# EasyEDA Pro project ProPrj_15串v2.0_2025-09-09.epro

# Schematic 15串v2.0
Board Name: 15串; Create Date: 2025-01-18; Page Name: P1; Project Name: 15串v2.0; Schematic Name: 15串v2.0; Update Date: 2025-01-21; Company: HUR; Page Size: A2; Version: V1.0
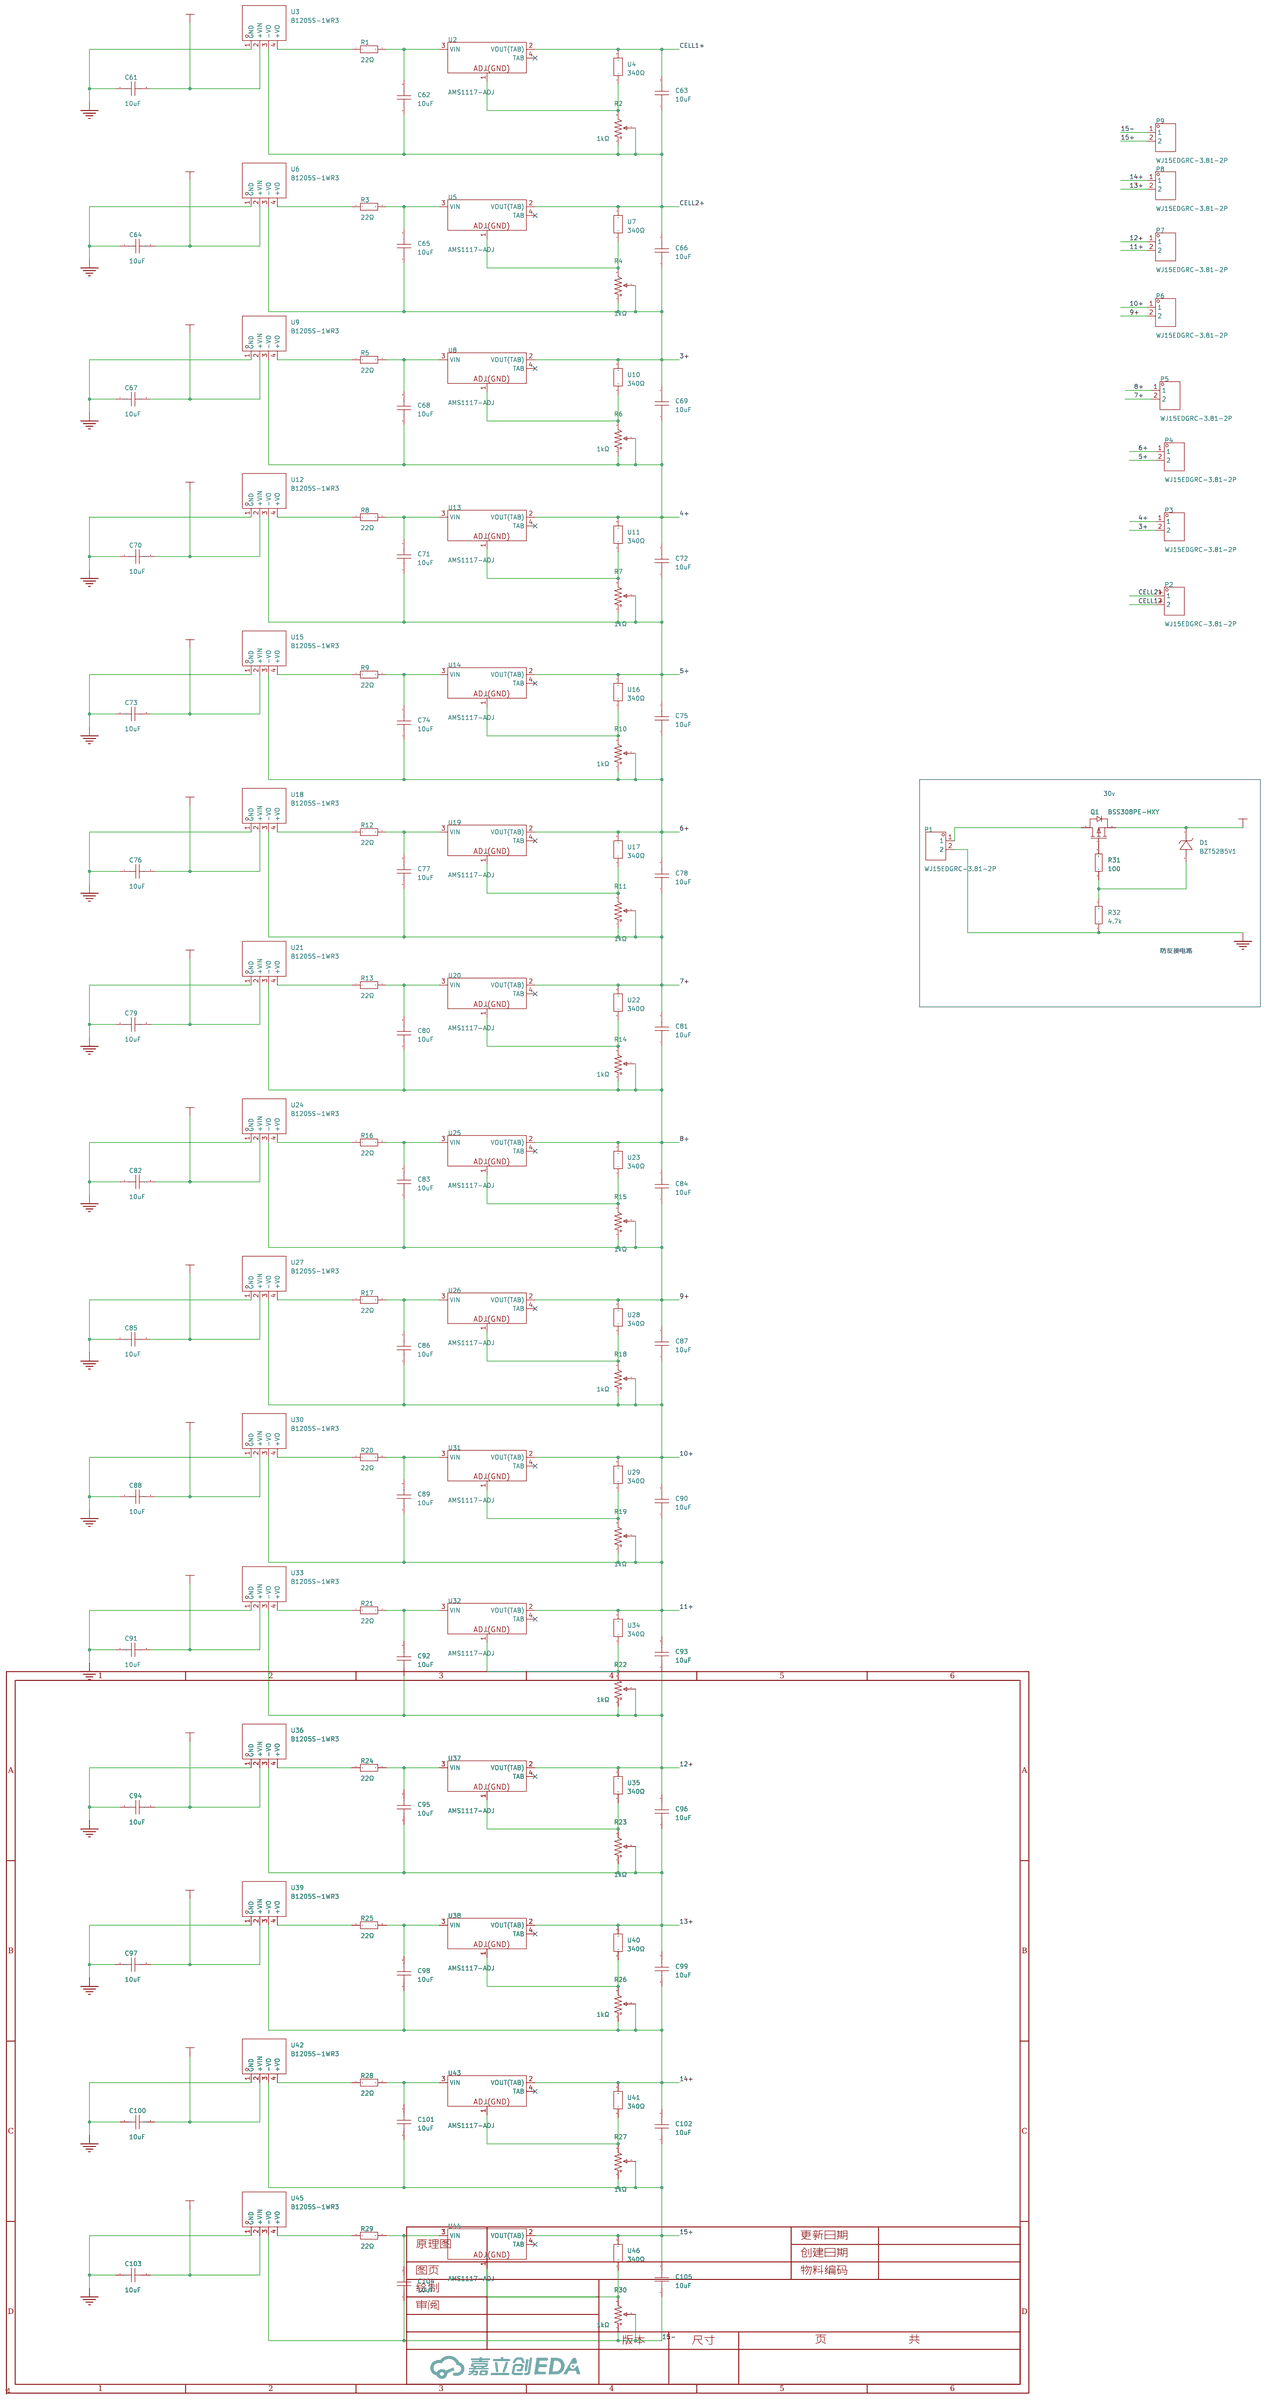
[diagram p0: schematic sheet]

## Parts
C61  10uF  [C0805]
C62  10uF  [C0805]
C63  10uF  [C0805]
C64  10uF  [C0805]
C65  10uF  [C0805]
C66  10uF  [C0805]
C67  10uF  [C0805]
C68  10uF  [C0805]
C69  10uF  [C0805]
C70  10uF  [C0805]
C71  10uF  [C0805]
C72  10uF  [C0805]
C73  10uF  [C0805]
C74  10uF  [C0805]
C75  10uF  [C0805]
C76  10uF  [C0805]
C77  10uF  [C0805]
C78  10uF  [C0805]
C79  10uF  [C0805]
C80  10uF  [C0805]
C81  10uF  [C0805]
C82  10uF  [C0805]
C83  10uF  [C0805]
C84  10uF  [C0805]
C85  10uF  [C0805]
C86  10uF  [C0805]
C87  10uF  [C0805]
C88  10uF  [C0805]
C89  10uF  [C0805]
C90  10uF  [C0805]
C91  10uF  [C0805]
C92  10uF  [C0805]
C93  10uF  [C0805]
C94  10uF  [C0805]
C95  10uF  [C0805]
C96  10uF  [C0805]
C97  10uF  [C0805]
C98  10uF  [C0805]
C99  10uF  [C0805]
C100  10uF  [C0805]
C101  10uF  [C0805]
C102  10uF  [C0805]
C103  10uF  [C0805]
C104  10uF  [C0805]
C105  10uF  [C0805]
D1  BZT52B5V1  [SOD-123_L2.7-W1.6-LS3.7-RD]
P1  WJ15EDGRC-3.81-2P  [CONN-TH_2P-P3.81_WJ15EDGRC-3.81-2P]
P2  WJ15EDGRC-3.81-2P  [CONN-TH_2P-P3.81_WJ15EDGRC-3.81-2P]
P3  WJ15EDGRC-3.81-2P  [CONN-TH_2P-P3.81_WJ15EDGRC-3.81-2P]
P4  WJ15EDGRC-3.81-2P  [CONN-TH_2P-P3.81_WJ15EDGRC-3.81-2P]
P5  WJ15EDGRC-3.81-2P  [CONN-TH_2P-P3.81_WJ15EDGRC-3.81-2P]
P6  WJ15EDGRC-3.81-2P  [CONN-TH_2P-P3.81_WJ15EDGRC-3.81-2P]
P7  WJ15EDGRC-3.81-2P  [CONN-TH_2P-P3.81_WJ15EDGRC-3.81-2P]
P8  WJ15EDGRC-3.81-2P  [CONN-TH_2P-P3.81_WJ15EDGRC-3.81-2P]
P9  WJ15EDGRC-3.81-2P  [CONN-TH_2P-P3.81_WJ15EDGRC-3.81-2P]
Q1  BSS308PE-HXY  [SOT-23-3_L2.9-W1.3-P1.90-LS2.4-BR]
R1  22Ω  [R0805]
R2  1kΩ  [RES-ADJ-TH_3296W]
R3  22Ω  [R0805]
R4  1kΩ  [RES-ADJ-TH_3296W]
R5  22Ω  [R0805]
R6  1kΩ  [RES-ADJ-TH_3296W]
R7  1kΩ  [RES-ADJ-TH_3296W]
R8  22Ω  [R0805]
R9  22Ω  [R0805]
R10  1kΩ  [RES-ADJ-TH_3296W]
R11  1kΩ  [RES-ADJ-TH_3296W]
R12  22Ω  [R0805]
R13  22Ω  [R0805]
R14  1kΩ  [RES-ADJ-TH_3296W]
R15  1kΩ  [RES-ADJ-TH_3296W]
R16  22Ω  [R0805]
R17  22Ω  [R0805]
R18  1kΩ  [RES-ADJ-TH_3296W]
R19  1kΩ  [RES-ADJ-TH_3296W]
R20  22Ω  [R0805]
R21  22Ω  [R0805]
R22  1kΩ  [RES-ADJ-TH_3296W]
R23  1kΩ  [RES-ADJ-TH_3296W]
R24  22Ω  [R0805]
R25  22Ω  [R0805]
R26  1kΩ  [RES-ADJ-TH_3296W]
R27  1kΩ  [RES-ADJ-TH_3296W]
R28  22Ω  [R0805]
R29  22Ω  [R0805]
R30  1kΩ  [RES-ADJ-TH_3296W]
R31  100  [R0805]
R32  4.7k  [R0805]
U2  AMS1117-ADJ  [SOT-223_L6.7-W3.5-P2.30-BR]
U3  B1205S-1WR3  [PWRM-TH_BXXXXS-1WR3]
U4  340Ω  [R0805]
U5  AMS1117-ADJ  [SOT-223_L6.7-W3.5-P2.30-BR]
U6  B1205S-1WR3  [PWRM-TH_BXXXXS-1WR3]
U7  340Ω  [R0805]
U8  AMS1117-ADJ  [SOT-223_L6.7-W3.5-P2.30-BR]
U9  B1205S-1WR3  [PWRM-TH_BXXXXS-1WR3]
U10  340Ω  [R0805]
U11  340Ω  [R0805]
U12  B1205S-1WR3  [PWRM-TH_BXXXXS-1WR3]
U13  AMS1117-ADJ  [SOT-223_L6.7-W3.5-P2.30-BR]
U14  AMS1117-ADJ  [SOT-223_L6.7-W3.5-P2.30-BR]
U15  B1205S-1WR3  [PWRM-TH_BXXXXS-1WR3]
U16  340Ω  [R0805]
U17  340Ω  [R0805]
U18  B1205S-1WR3  [PWRM-TH_BXXXXS-1WR3]
U19  AMS1117-ADJ  [SOT-223_L6.7-W3.5-P2.30-BR]
U20  AMS1117-ADJ  [SOT-223_L6.7-W3.5-P2.30-BR]
U21  B1205S-1WR3  [PWRM-TH_BXXXXS-1WR3]
U22  340Ω  [R0805]
U23  340Ω  [R0805]
U24  B1205S-1WR3  [PWRM-TH_BXXXXS-1WR3]
U25  AMS1117-ADJ  [SOT-223_L6.7-W3.5-P2.30-BR]
U26  AMS1117-ADJ  [SOT-223_L6.7-W3.5-P2.30-BR]
U27  B1205S-1WR3  [PWRM-TH_BXXXXS-1WR3]
U28  340Ω  [R0805]
U29  340Ω  [R0805]
U30  B1205S-1WR3  [PWRM-TH_BXXXXS-1WR3]
U31  AMS1117-ADJ  [SOT-223_L6.7-W3.5-P2.30-BR]
U32  AMS1117-ADJ  [SOT-223_L6.7-W3.5-P2.30-BR]
U33  B1205S-1WR3  [PWRM-TH_BXXXXS-1WR3]
U34  340Ω  [R0805]
U35  340Ω  [R0805]
U36  B1205S-1WR3  [PWRM-TH_BXXXXS-1WR3]
U37  AMS1117-ADJ  [SOT-223_L6.7-W3.5-P2.30-BR]
U38  AMS1117-ADJ  [SOT-223_L6.7-W3.5-P2.30-BR]
U39  B1205S-1WR3  [PWRM-TH_BXXXXS-1WR3]
U40  340Ω  [R0805]
U41  340Ω  [R0805]
U42  B1205S-1WR3  [PWRM-TH_BXXXXS-1WR3]
U43  AMS1117-ADJ  [SOT-223_L6.7-W3.5-P2.30-BR]
U44  AMS1117-ADJ  [SOT-223_L6.7-W3.5-P2.30-BR]
U45  B1205S-1WR3  [PWRM-TH_BXXXXS-1WR3]
U46  340Ω  [R0805]

## Library data of the parts
C61-C105 = CL21A106KAYNNNE_C15850: 容值:10uF;精度:±10%;额定电压:25V;材质(温度系数):X5R;; LCSC Part Name: 10uF ±10% 25V; Supplier Part: C15850; Manufacturer: SAMSUNG(三星); Manufacturer Part: CL21A106KAYNNNE; Supplier Footprint: 0805; JLCPCB Part Class: 基础库; Datasheet: https://atta.szlcsc.com/upload/public/pdf/source/20160218/1457707763339.pdf; Supplier: LCSC; Tolerance: ±10%; Voltage Rated: 25V; Temperature Coefficient: X5R
D1 = BZT52B5V1_C19077393: 二极管配置:独立式;稳压值(标称值):5.1V;稳压值(范围):5V~5.2V;耗散功率(Pd):500mW;; Supplier Part: C19077393; Manufacturer: 宏嘉诚; Supplier Footprint: SOD-123; JLCPCB Part Class: 扩展库; Datasheet: https://atta.szlcsc.com/upload/public/pdf/source/20250106/AFD01FE5B0C707EDCEE558C585303F64.pdf; Supplier: LCSC; Diode Configuration: 独立式; Zener Voltage(Nom): 5.1V; Reverse Leakage Current (Ir): 2uA@2V; Zener Voltage(Range): 5V~5.2V; Pd - Power Dissipation(Pd): 500mW; Impedance(Zzt): 60Ω
P1-P9 = WJ15EDGRC-3.81-2P: 连接器类型:板端/插座-闭口;固定方式:-;结构:1x2P;间距:3.81mm;颜色:-;安装方式:弯针;排数:1;每排PIN数:2;额定电流:8A;额定电压:300V;线规 - AWG:-;线规 - 平方毫米:-;触头材质:黄铜;触头镀层:锡;工作温度范围:-40℃~+105℃;焊接温度(最大值):-;; LCSC Part Name: 1x2P 3.81mm 排数:1 每排P数:2; Supplier Part: C8387; Manufacturer: KANGNEX(康奈克斯电气); Supplier Footprint: 弯插,P=3.81mm; JLCPCB Part Class: 扩展库; Datasheet: https://atta.szlcsc.com/upload/public/pdf/source/20191225/C8387_8EBAF10345D2762F0167C8753398EEFA.pdf; Supplier: LCSC; Connector Type: 板端/插座-闭口; Structure: 1x2P; Pitch: 3.81mm; Mounting Style: 弯针; Number of Pins: 2P; Number of Rows: 1; Number of PINs Per Row: 2; Current Rating (Max): 8A; Voltage Rating (Max): 300V; Contact Material: 黄铜; Contact Plating: 锡; Operating Temperature Range: -40℃~+105℃
Q1 = BSS308PE-HXY: 类型:1个P沟道;漏源电压(Vdss):30V;连续漏极电流(Id):4.1A;导通电阻(RDS(on)):56mΩ@10V,4.1A;耗散功率(Pd):1.32W;阈值电压(Vgs(th)):1.5V;; LCSC Part Name: 1个P沟道 耐压:30V 电流:4.1A; Supplier Part: C5337195; Manufacturer: HXY MOSFET(华轩阳电子); Supplier Footprint: SOT-23; JLCPCB Part Class: 扩展库; Datasheet: https://atta.szlcsc.com/upload/public/pdf/source/20230104/E39C650DE7A20C89BAEDF2C41FB7331C.pdf; Supplier: LCSC; Type: 1个P沟道; Drain Source Voltage (Vdss): 30V; Continuous Drain Current (Id): 4.1A; RDS(on): 56mΩ@10V,4.1A; Pd - Power Dissipation(Pd): 1.32W; Gate Threshold Voltage (Vgs(th)@Id): 1.5V; Total Gate Charge (Qg@Vgs): 7.3nC@4.5V; Input Capacitance(Ciss@Vds): 650pF@15V; Reverse Transfer Capacitance (Crss@Vds): 95pF@15V; Operating Temperature: -55℃~+150℃
R1 R3 R5 R8 R9 R12 R13 R16 R17 R20 R21 R24 R25 R28 R29 = 0805W8J0220T5E: 电阻类型:厚膜电阻;阻值:22Ω;精度:±5%;功率:125mW;最大工作电压:150V;温度系数:±200ppm/℃;; LCSC Part Name: 22Ω ±5% 125mW 厚膜电阻; Supplier Part: C25295; Manufacturer: UNI-ROYAL(厚声); Supplier Footprint: 0805; JLCPCB Part Class: 扩展库; Datasheet: https://atta.szlcsc.com/upload/public/pdf/source/20200306/C422600_1E6D84923E4A46A82E41ADD87F860B5C.pdf; Supplier: LCSC; Type: 厚膜电阻; Tolerance: ±5%; Power(Watts): 125mW; Overload Voltage (Max): 150V; Temperature Coefficient: ±200ppm/℃; Operating Temperature Range: -55℃~+155℃
R2 R4 R6 R7 R10 R11 R14 R15 R18 R19 R22 R23 R26 R27 R30 = 3296W-1-102-8mm_C2766201: 阻值:1kΩ;精度:±10%;功率:500mW;; LCSC Part Name: 1kΩ ±10%; Supplier Part: C2766201; Manufacturer: BOCHEN(博晨); Manufacturer Part: 3296W-1-102-8mm; Supplier Footprint: 插件; JLCPCB Part Class: 扩展库; Datasheet: https://atta.szlcsc.com/upload/public/pdf/source/20181127/C330429_FEC3738CC66D226D2C83EEA9DBFCD01B.pdf; Supplier: LCSC; Tolerance: ±10%; Power(Watts): 500mW; Turns: 25
R31 R32 = Res_0805: Supplier Footprint: 0805
U2 U5 U8 U13 U14 U19 U20 U25 U26 U31 U32 U37 U38 U43 U44 = AMS1117-ADJ_C347224: 输出类型:可调;工作电压:18V;输出电压:1.25V~10V;输出电流:1A;电源纹波抑制比(PSRR):60dB@(120Hz);输出极性:正极;; LCSC Part Name: 输出可调 电流:1A 耐压:12V; Supplier Part: C347224; Manufacturer: UMW(友台半导体); Supplier Footprint: SOT-223; JLCPCB Part Class: 扩展库; Datasheet: https://atta.szlcsc.com/upload/public/pdf/source/20241218/BAF0263FA2E44BCD8AF41AA4FA04EFAA.pdf; Supplier: LCSC; Output Type: 可调; Maximum Input Voltage: 18V; Output Voltage: 1.25V~10V; Output Current: 1A; Power Supply Rejection Ratio (PSRR): 60dB@(120Hz); Dropout Voltage: 1.2V@1A; standby current: 5mA; Noise: 120uV; Feature: 过流保护；过热保护; Operating Temperature: -40℃~+125℃; Output Polarity: 正极; Number of Outputs: 1
U3 U6 U9 U12 U15 U18 U21 U24 U27 U30 U33 U36 U39 U42 U45 = B1205S-1WR3_C5264430: 尺寸：11.6*10*6mm 保护方式：短路保护（可持续自恢复）; Supplier Part: C5264430; Manufacturer: ZOEYGO(中逸光); Supplier Footprint: SIP-4; JLCPCB Part Class: 扩展库; Datasheet: https://atta.szlcsc.com/upload/public/pdf/source/20221115/CCCC2208ABF46D1CC4396DBF6A227367.pdf; Supplier: LCSC; Number of channel: 1; Power: 1W; input voltage (Vdc): 10.8V~13.2V; Conversion Efficiency: 82%; Output Voltage: 5V; Output Current (Max): 200mA; Insulated Voltage: 1.5kV
U4 U7 U10 U11 U16 U17 U22 U23 U28 U29 U34 U35 U40 U41 U46 = FRC0805F3400TS: 电阻类型:厚膜电阻;阻值:340Ω;精度:±1%;功率:125mW;温度系数:±100ppm/℃;; LCSC Part Name: 厚膜电阻 340Ω ±1% 125mW; Supplier Part: C7467322; Manufacturer: FOJAN(富捷); Supplier Footprint: 0805; JLCPCB Part Class: 扩展库; Datasheet: https://atta.szlcsc.com/upload/public/pdf/source/20211221/9022FBEBBD509006A57EBC43C1F2F40C.pdf; Supplier: LCSC; Type: 厚膜电阻; Tolerance: ±1%; Power(Watts): 125mW; Temperature Coefficient: ±100ppm/℃

## Nets
12V: C61.2 C64.2 C67.2 C70.2 C73.2 C76.2 C79.2 C82.2 C85.2 C88.2 C91.2 C94.2 C97.2 C100.2 C103.2 D1.1(K) Q1.2(S) U3.2(+VIN) U6.2(+VIN) U9.2(+VIN) U12.2(+VIN) U15.2(+VIN) U18.2(+VIN) U21.2(+VIN) U24.2(+VIN) U27.2(+VIN) U30.2(+VIN) U33.2(+VIN) U36.2(+VIN) U39.2(+VIN) U42.2(+VIN) U45.2(+VIN)
GND: C61.1 C64.1 C67.1 C70.1 C73.1 C76.1 C79.1 C82.1 C85.1 C88.1 C91.1 C94.1 C97.1 C100.1 C103.1 P1.2 R32.1 U3.1(GND) U6.1(GND) U9.1(GND) U12.1(GND) U15.1(GND) U18.1(GND) U21.1(GND) U24.1(GND) U27.1(GND) U30.1(GND) U33.1(GND) U36.1(GND) U39.1(GND) U42.1(GND) U45.1(GND)
3+: C65.1 C66.1 C69.2 P3.2 R4.1 R4.2 U6.3(-VO) U8.2(VOUT(TAB)) U10.2
4+: C68.1 C69.1 C72.2 P3.1 R6.1 R6.2 U9.3(-VO) U11.2 U13.2(VOUT(TAB))
5+: C71.1 C72.1 C75.2 P4.2 R7.1 R7.2 U12.3(-VO) U14.2(VOUT(TAB)) U16.2
6+: C74.1 C75.1 C78.2 P4.1 R10.1 R10.2 U15.3(-VO) U17.2 U19.2(VOUT(TAB))
7+: C77.1 C78.1 C81.2 P5.2 R11.1 R11.2 U18.3(-VO) U20.2(VOUT(TAB)) U22.2
8+: C80.1 C81.1 C84.2 P5.1 R14.1 R14.2 U21.3(-VO) U23.2 U25.2(VOUT(TAB))
9+: C83.1 C84.1 C87.2 P6.2 R15.1 R15.2 U24.3(-VO) U26.2(VOUT(TAB)) U28.2
10+: C86.1 C87.1 C90.2 P6.1 R18.1 R18.2 U27.3(-VO) U29.2 U31.2(VOUT(TAB))
11+: C89.1 C90.1 C93.2 P7.2 R19.1 R19.2 U30.3(-VO) U32.2(VOUT(TAB)) U34.2
12+: C92.1 C93.1 C96.2 P7.1 R22.1 R22.2 U33.3(-VO) U35.2 U37.2(VOUT(TAB))
13+: C95.1 C96.1 C99.2 P8.2 R23.1 R23.2 U36.3(-VO) U38.2(VOUT(TAB)) U40.2
14+: C98.1 C99.1 C102.2 P8.1 R26.1 R26.2 U39.3(-VO) U41.2 U43.2(VOUT(TAB))
15+: C101.1 C102.1 C105.2 P9.2 R27.1 R27.2 U42.3(-VO) U44.2(VOUT(TAB)) U46.2
15-: C104.1 C105.1 P9.1 R30.1 R30.2 U45.3(-VO)
CELL1+: C63.2 P2.2 U2.2(VOUT(TAB)) U4.2
CELL2+: C62.1 C63.1 C66.2 P2.1 R2.1 R2.2 U3.3(-VO) U5.2(VOUT(TAB)) U7.2
$1N493: R1.1 U3.4(+VO)
$1N497: C62.2 R1.2 U2.3(VIN)
$1N622: R2.3 U2.1(ADJ(GND)) U4.1
$1N1378: R3.1 U6.4(+VO)
$1N1380: C65.2 R3.2 U5.3(VIN)
$1N1394: R4.3 U5.1(ADJ(GND)) U7.1
$1N18381: R5.1 U9.4(+VO)
$1N18382: C68.2 R5.2 U8.3(VIN)
$1N18399: R6.3 U8.1(ADJ(GND)) U10.1
$1N18414: R7.3 U11.1 U13.1(ADJ(GND))
$1N18415: C71.2 R8.2 U13.3(VIN)
$1N18416: R8.1 U12.4(+VO)
$1N19757: R9.1 U15.4(+VO)
$1N19758: C74.2 R9.2 U14.3(VIN)
$1N19775: R10.3 U14.1(ADJ(GND)) U16.1
$1N19794: R11.3 U17.1 U19.1(ADJ(GND))
$1N19795: C77.2 R12.2 U19.3(VIN)
$1N19796: R12.1 U18.4(+VO)
$1N19805: R13.1 U21.4(+VO)
$1N19806: C80.2 R13.2 U20.3(VIN)
$1N19823: R14.3 U20.1(ADJ(GND)) U22.1
$1N19835: R15.3 U23.1 U25.1(ADJ(GND))
$1N19836: C83.2 R16.2 U25.3(VIN)
$1N19837: R16.1 U24.4(+VO)
$1N21181: R17.1 U27.4(+VO)
$1N21182: C86.2 R17.2 U26.3(VIN)
$1N21199: R18.3 U26.1(ADJ(GND)) U28.1
$1N21218: R19.3 U29.1 U31.1(ADJ(GND))
$1N21219: C89.2 R20.2 U31.3(VIN)
$1N21220: R20.1 U30.4(+VO)
$1N21229: R21.1 U33.4(+VO)
$1N21230: C92.2 R21.2 U32.3(VIN)
$1N21247: R22.3 U32.1(ADJ(GND)) U34.1
$1N21259: R23.3 U35.1 U37.1(ADJ(GND))
$1N21260: C95.2 R24.2 U37.3(VIN)
$1N21261: R24.1 U36.4(+VO)
$1N22605: R25.1 U39.4(+VO)
$1N22606: C98.2 R25.2 U38.3(VIN)
$1N22623: R26.3 U38.1(ADJ(GND)) U40.1
$1N22642: R27.3 U41.1 U43.1(ADJ(GND))
$1N22643: C101.2 R28.2 U43.3(VIN)
$1N22644: R28.1 U42.4(+VO)
$1N22653: R29.1 U45.4(+VO)
$1N22654: C104.2 R29.2 U44.3(VIN)
$1N22671: R30.3 U44.1(ADJ(GND)) U46.1
$1N26283: Q1.1(G) R31.2
$1N26335: D1.2(A) R31.1 R32.2
$1N26450: P1.1 Q1.3(D)

Not connected (* = marked no-connect by the designer): U2 4(TAB)*; U5 4(TAB)*; U8 4(TAB)*; U13 4(TAB)*; U14 4(TAB)*; U19 4(TAB)*; U20 4(TAB)*; U25 4(TAB)*; U26 4(TAB)*; U31 4(TAB)*; U32 4(TAB)*; U37 4(TAB)*; U38 4(TAB)*; U43 4(TAB)*; U44 4(TAB)*

## Notes on the sheet
- 30v
- 防反接电路

# Board PCB2
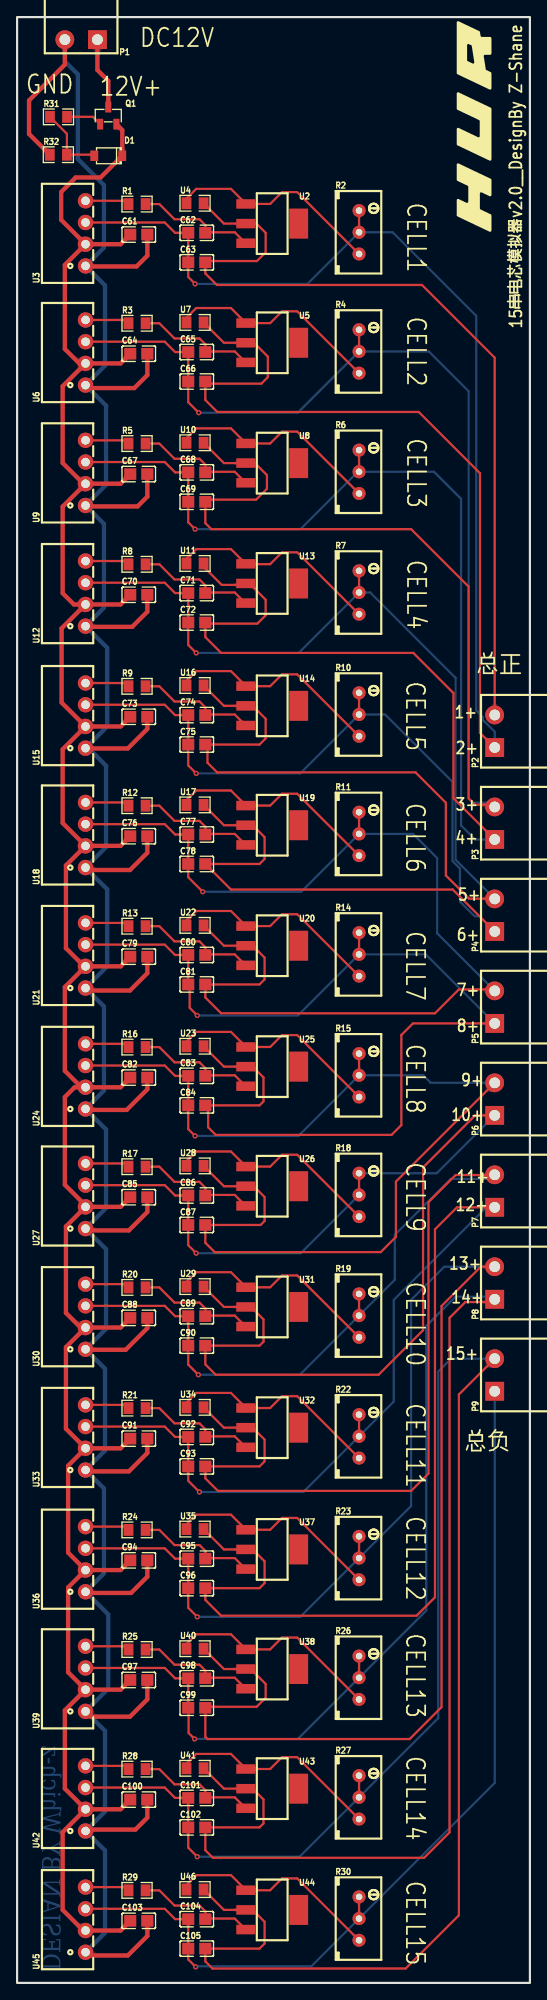
[diagram p1: board, top side]
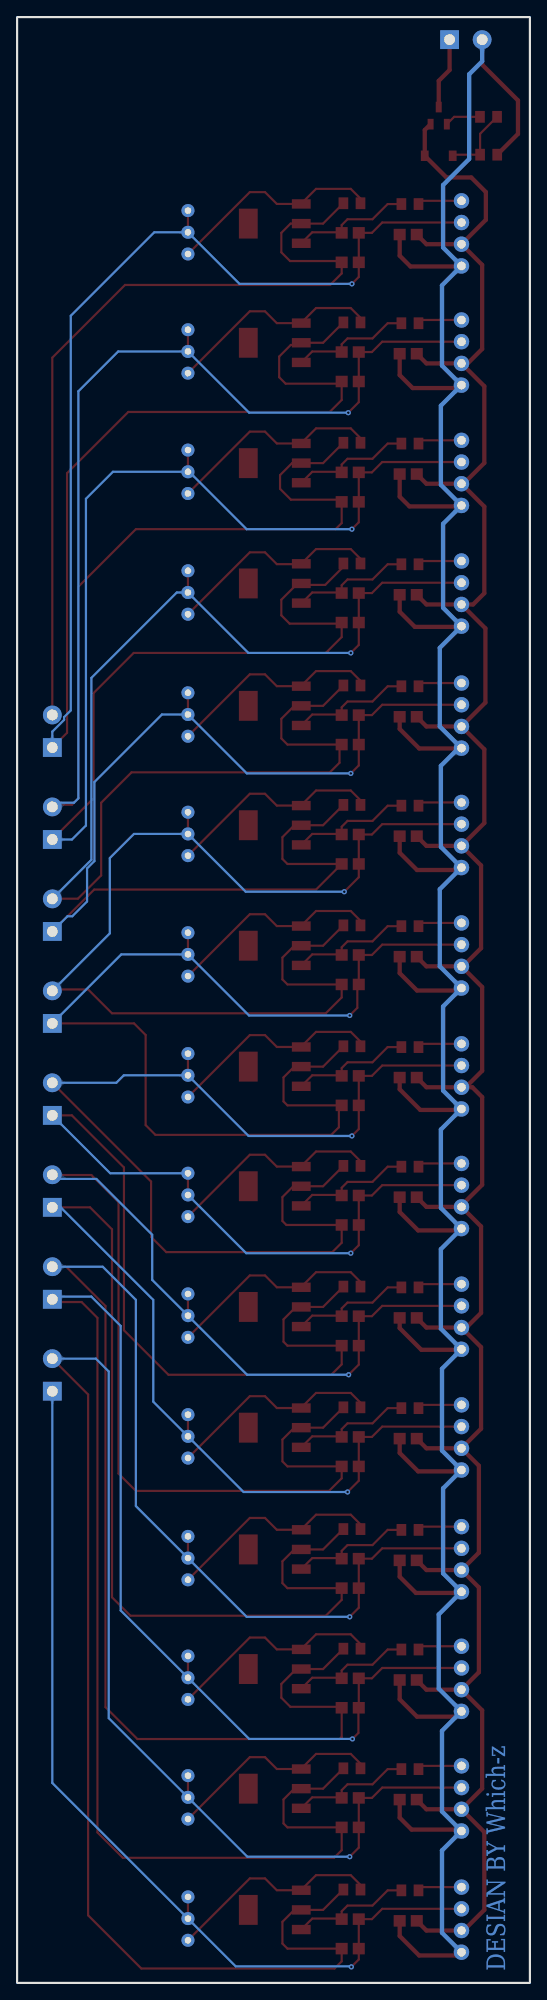
[diagram p2: board, bottom side, seen from below]

Outline 60 x 230 mm; copper layers: Top Layer, Bottom Layer. Coordinates in mm from the lower left corner of the outline.
Outline path: rectangle 0,230 60,0
Stack: Top Layer 0.035mm / Dielectric1 1.51mm FR4 er 4.5 / Bottom Layer 0.035mm

## Design rules (mm)
template: JLCPCB Capability(Two Layers Board)
spacing copperThickness1oz (default): track to track 0.102, other pairs 0.152 to 0.3
spacing copperThickness2oz: track to track 0.203, other pairs 0.152 to 0.3
track width copperThickness1oz (default): min 0.127, default 0.254, max 2.54
track width copperThickness2oz: min 0.203, default 0.254, max 2.54
differential pair differentialPair (default): width min 0.127, default 0.254, max 2.54; gap min 0.152, default 0.152
via viaSize (default): diameter min 0.5, default 0.61, max 10; hole min 0.3, default 0.305, max 6.3

## Placement (name value [footprint] x y rotation side)
C61  10uF  [C0805]  14.24 204.56 180 top
C62  10uF  [C0805]  21.02 204.76 0 top
C63  10uF  [C0805]  21.02 201.31 0 top
C64  10uF  [C0805]  14.24 190.61 180 top
C65  10uF  [C0805]  21.02 190.81 0 top
C66  10uF  [C0805]  21.02 187.36 0 top
C67  10uF  [C0805]  14.24 176.53 180 top
C68  10uF  [C0805]  21.02 176.73 0 top
C69  10uF  [C0805]  21.02 173.28 0 top
C70  10uF  [C0805]  14.24 162.41 180 top
C71  10uF  [C0805]  21.02 162.61 0 top
C72  10uF  [C0805]  21.02 159.16 0 top
C73  10uF  [C0805]  14.24 148.14 180 top
C74  10uF  [C0805]  21.02 148.33 0 top
C75  10uF  [C0805]  21.02 144.89 0 top
C76  10uF  [C0805]  14.24 134.17 180 top
C77  10uF  [C0805]  21.02 134.37 0 top
C78  10uF  [C0805]  21.02 130.92 0 top
C79  10uF  [C0805]  14.24 120.07 180 top
C80  10uF  [C0805]  21.02 120.27 0 top
C81  10uF  [C0805]  21.02 116.82 0 top
C82  10uF  [C0805]  14.24 105.92 180 top
C83  10uF  [C0805]  21.02 106.12 0 top
C84  10uF  [C0805]  21.02 102.67 0 top
C85  10uF  [C0805]  14.24 91.93 180 top
C86  10uF  [C0805]  21.02 92.13 0 top
C87  10uF  [C0805]  21.02 88.68 0 top
C88  10uF  [C0805]  14.24 77.81 180 top
C89  10uF  [C0805]  21.02 78.01 0 top
C90  10uF  [C0805]  21.02 74.56 0 top
C91  10uF  [C0805]  14.24 63.68 180 top
C92  10uF  [C0805]  21.02 63.88 0 top
C93  10uF  [C0805]  21.02 60.43 0 top
C94  10uF  [C0805]  14.24 49.44 180 top
C95  10uF  [C0805]  21.02 49.63 0 top
C96  10uF  [C0805]  21.02 46.19 0 top
C97  10uF  [C0805]  14.24 35.44 180 top
C98  10uF  [C0805]  21.02 35.64 0 top
C99  10uF  [C0805]  21.02 32.19 0 top
C100  10uF  [C0805]  14.24 21.45 180 top
C101  10uF  [C0805]  21.02 21.65 0 top
C102  10uF  [C0805]  21.02 18.2 0 top
C103  10uF  [C0805]  14.24 7.26 180 top
C104  10uF  [C0805]  21.02 7.46 0 top
C105  10uF  [C0805]  21.02 4.01 0 top
D1  BZT52B5V1  [SOD-123_L2.7-W1.6-LS3.7-RD]  10.67 213.77 180 top
P1  WJ15EDGRC-3.81-2P  [CONN-TH_2P-P3.81_WJ15EDGRC-3.81-2P]  7.49 227.36 180 top
P2  WJ15EDGRC-3.81-2P  [CONN-TH_2P-P3.81_WJ15EDGRC-3.81-2P]  55.88 146.44 90 top
P3  WJ15EDGRC-3.81-2P  [CONN-TH_2P-P3.81_WJ15EDGRC-3.81-2P]  55.88 135.68 90 top
P4  WJ15EDGRC-3.81-2P  [CONN-TH_2P-P3.81_WJ15EDGRC-3.81-2P]  55.88 124.93 90 top
P5  WJ15EDGRC-3.81-2P  [CONN-TH_2P-P3.81_WJ15EDGRC-3.81-2P]  55.88 114.17 90 top
P6  WJ15EDGRC-3.81-2P  [CONN-TH_2P-P3.81_WJ15EDGRC-3.81-2P]  55.88 103.41 90 top
P7  WJ15EDGRC-3.81-2P  [CONN-TH_2P-P3.81_WJ15EDGRC-3.81-2P]  55.88 92.65 90 top
P8  WJ15EDGRC-3.81-2P  [CONN-TH_2P-P3.81_WJ15EDGRC-3.81-2P]  55.88 81.89 90 top
P9  WJ15EDGRC-3.81-2P  [CONN-TH_2P-P3.81_WJ15EDGRC-3.81-2P]  55.88 71.13 90 top
Q1  BSS308PE-HXY  [SOT-23-3_L2.9-W1.3-P1.90-LS2.4-BR]  10.67 218.47 270 top
R1  22Ω  [R0805]  14.03 208.12 0 top
R2  1kΩ  [RES-ADJ-TH_3296W]  40.01 204.82 0 top
R3  22Ω  [R0805]  14.03 194.18 0 top
R4  1kΩ  [RES-ADJ-TH_3296W]  40.01 190.88 0 top
R5  22Ω  [R0805]  14.03 180.1 0 top
R6  1kΩ  [RES-ADJ-TH_3296W]  40.01 176.8 0 top
R7  1kΩ  [RES-ADJ-TH_3296W]  40.01 162.68 0 top
R8  22Ω  [R0805]  14.03 165.98 0 top
R9  22Ω  [R0805]  14.03 151.7 0 top
R10  1kΩ  [RES-ADJ-TH_3296W]  40.01 148.4 0 top
R11  1kΩ  [RES-ADJ-TH_3296W]  40.01 134.43 0 top
R12  22Ω  [R0805]  14.03 137.73 0 top
R13  22Ω  [R0805]  14.03 123.64 0 top
R14  1kΩ  [RES-ADJ-TH_3296W]  40.01 120.33 0 top
R15  1kΩ  [RES-ADJ-TH_3296W]  40.01 106.19 0 top
R16  22Ω  [R0805]  14.03 109.49 0 top
R17  22Ω  [R0805]  14.03 95.5 0 top
R18  1kΩ  [RES-ADJ-TH_3296W]  40.01 92.19 0 top
R19  1kΩ  [RES-ADJ-TH_3296W]  40.01 78.07 0 top
R20  22Ω  [R0805]  14.03 81.37 0 top
R21  22Ω  [R0805]  14.03 67.25 0 top
R22  1kΩ  [RES-ADJ-TH_3296W]  40.01 63.95 0 top
R23  1kΩ  [RES-ADJ-TH_3296W]  40.01 49.7 0 top
R24  22Ω  [R0805]  14.03 53 0 top
R25  22Ω  [R0805]  14.03 39.01 0 top
R26  1kΩ  [RES-ADJ-TH_3296W]  40.01 35.71 0 top
R27  1kΩ  [RES-ADJ-TH_3296W]  40.01 21.71 0 top
R28  22Ω  [R0805]  14.03 25.01 0 top
R29  22Ω  [R0805]  14.03 10.83 0 top
R30  1kΩ  [RES-ADJ-TH_3296W]  40.01 7.53 0 top
R31  100  [R0805]  4.84 218.33 0 top
R32  4.7k  [R0805]  4.83 213.9 0 top
U2  AMS1117-ADJ  [SOT-223_L6.7-W3.5-P2.30-BR]  29.85 205.84 180 top
U3  B1205S-1WR3  [PWRM-TH_BXXXXS-1WR3]  8.01 204.7 90 top
U4  340Ω  [R0805]  20.82 208.22 0 top
U5  AMS1117-ADJ  [SOT-223_L6.7-W3.5-P2.30-BR]  29.85 191.9 180 top
U6  B1205S-1WR3  [PWRM-TH_BXXXXS-1WR3]  8.01 190.75 90 top
U7  340Ω  [R0805]  20.82 194.28 0 top
U8  AMS1117-ADJ  [SOT-223_L6.7-W3.5-P2.30-BR]  29.85 177.81 180 top
U9  B1205S-1WR3  [PWRM-TH_BXXXXS-1WR3]  8.01 176.67 90 top
U10  340Ω  [R0805]  20.82 180.2 0 top
U11  340Ω  [R0805]  20.82 166.07 0 top
U12  B1205S-1WR3  [PWRM-TH_BXXXXS-1WR3]  8.01 162.55 90 top
U13  AMS1117-ADJ  [SOT-223_L6.7-W3.5-P2.30-BR]  29.84 163.74 180 top
U14  AMS1117-ADJ  [SOT-223_L6.7-W3.5-P2.30-BR]  29.85 149.42 180 top
U15  B1205S-1WR3  [PWRM-TH_BXXXXS-1WR3]  8.01 148.27 90 top
U16  340Ω  [R0805]  20.82 151.8 0 top
U17  340Ω  [R0805]  20.82 137.83 0 top
U18  B1205S-1WR3  [PWRM-TH_BXXXXS-1WR3]  8.01 134.3 90 top
U19  AMS1117-ADJ  [SOT-223_L6.7-W3.5-P2.30-BR]  29.85 135.45 180 top
U20  AMS1117-ADJ  [SOT-223_L6.7-W3.5-P2.30-BR]  29.85 121.35 180 top
U21  B1205S-1WR3  [PWRM-TH_BXXXXS-1WR3]  8.01 120.21 90 top
U22  340Ω  [R0805]  20.82 123.73 0 top
U23  340Ω  [R0805]  20.82 109.59 0 top
U24  B1205S-1WR3  [PWRM-TH_BXXXXS-1WR3]  8.01 106.06 90 top
U25  AMS1117-ADJ  [SOT-223_L6.7-W3.5-P2.30-BR]  29.85 107.2 180 top
U26  AMS1117-ADJ  [SOT-223_L6.7-W3.5-P2.30-BR]  29.85 93.21 180 top
U27  B1205S-1WR3  [PWRM-TH_BXXXXS-1WR3]  8.01 92.07 90 top
U28  340Ω  [R0805]  20.82 95.59 0 top
U29  340Ω  [R0805]  20.82 81.47 0 top
U30  B1205S-1WR3  [PWRM-TH_BXXXXS-1WR3]  8.01 77.94 90 top
U31  AMS1117-ADJ  [SOT-223_L6.7-W3.5-P2.30-BR]  29.85 79.09 180 top
U32  AMS1117-ADJ  [SOT-223_L6.7-W3.5-P2.30-BR]  29.85 64.96 180 top
U33  B1205S-1WR3  [PWRM-TH_BXXXXS-1WR3]  8.01 63.82 90 top
U34  340Ω  [R0805]  20.82 67.34 0 top
U35  340Ω  [R0805]  20.82 53.1 0 top
U36  B1205S-1WR3  [PWRM-TH_BXXXXS-1WR3]  8.01 49.57 90 top
U37  AMS1117-ADJ  [SOT-223_L6.7-W3.5-P2.30-BR]  29.85 50.72 180 top
U38  AMS1117-ADJ  [SOT-223_L6.7-W3.5-P2.30-BR]  29.85 36.72 180 top
U39  B1205S-1WR3  [PWRM-TH_BXXXXS-1WR3]  8.01 35.58 90 top
U40  340Ω  [R0805]  20.82 39.1 0 top
U41  340Ω  [R0805]  20.82 25.11 0 top
U42  B1205S-1WR3  [PWRM-TH_BXXXXS-1WR3]  8.01 21.58 90 top
U43  AMS1117-ADJ  [SOT-223_L6.7-W3.5-P2.30-BR]  29.85 22.73 180 top
U44  AMS1117-ADJ  [SOT-223_L6.7-W3.5-P2.30-BR]  29.85 8.54 180 top
U45  B1205S-1WR3  [PWRM-TH_BXXXXS-1WR3]  8.01 7.4 90 top
U46  340Ω  [R0805]  20.82 10.92 0 top

## Footprints (pads in the part's own frame, mm; a bottom-side part is the same pattern mirrored in y, then rotated)
C0805
  rect 1.41x1.35 smd: 1(-1,0) 2(1,0)
CONN-TH_2P-P3.81_WJ15EDGRC-3.81-2P
  rect 2.2x2.2 hole 1.26: 1(-1.905,0)
  round 2.2 hole 1.26: 2(1.905,0)
PWRM-TH_BXXXXS-1WR3
  round 1.8 hole 1: 1(-3.81,0) 2(-1.27,0) 3(1.27,0) 4(3.81,0)
R0805
  rect 1.133x1.377 smd: 1(-1,0) 2(1,0)
RES-ADJ-TH_3296W
  round 1.524 hole 0.762: 1(0,2.54) 2(0,0) 3(0,-2.54)
SOD-123_L2.7-W1.6-LS3.7-RD
  rect 0.91x1.22 smd: 1(-1.635,0) 2(1.635,0)
SOT-23-3_L2.9-W1.3-P1.90-LS2.4-BR
  rect 1.25x0.7 smd: 1(1,-0.95) 2(1,0.95) 3(-1,0)
SOT-223_L6.7-W3.5-P2.30-BR
  rect 2.2x1.1 smd: 1(3.099,-2.3) 2(3.099,0) 3(3.099,2.3)
  rect 2.2x3.5 smd: 4(-3.099,0)

## Nets
As in the schematic.

Pads without a net: U2 4; U5 4; U8 4; U13 4; U14 4; U19 4; U20 4; U25 4; U26 4; U31 4; U32 4; U37 4; U38 4; U43 4; U44 4

## Via types
v1: diameter 0.61, hole 0.305, Top Layer to Bottom Layer, 15 vias

## Routing (per net, layer and track width the routed paths; a pad name or vN(x,y) marks a point on that pad's centre or on a via; arc(x,y) is an arc through that point)
12V: length 333.7
  Top Layer w0.5: Q1.2 12.3,216.79 D1.1 9.76,211.23 6.86,211.23 5.15,209.53 5.15,206.28 U3.2 ; U15.2 5.33,144.33 5.33,135.71 U18.2 ; U15.2 12.1,147 C73.2 ; U15.2 5.21,149.8 5.21,158.48 U12.2 ; U21.2 5.59,116.52 5.59,106.71 7.51,104.79 ; U21.2 7.84,118.94 5.72,121.06 5.72,130.74 U18.2 ; U21.2 12.1,118.94 C79.2 ; 8.01,76.68 12.1,76.68 C88.2 ; 8.01,76.68 5.72,74.38 5.72,64.84 U33.2 ; 8.01,76.68 7.43,76.68 5.72,78.39 5.72,88.51 U27.2 ; C61.2 12.1,203.43 U3.2 ; U6.2 7.27,189.48 5.59,191.17 5.59,201.01 U3.2 ; U6.2 5.33,186.81 5.33,177.83 7.77,175.4 U9.2 ; U6.2 12.1,189.48 C64.2 ; C100.2 12.1,20.31 U42.2 ; U33.2 5.97,60.51 5.97,50.34 U36.2 ; U33.2 12.1,62.55 C91.2 ; U18.2 12.1,133.03 C76.2 ; C103.2 12.1,6.13 U45.2 7.75,6.13 5.33,8.54 5.33,17.64 U42.2 ; U39.2 12.1,34.31 C97.2 ; U39.2 5.59,31.89 5.59,22.73 U42.2 ; U39.2 5.97,36.35 5.97,46.27 U36.2 ; U9.2 12.1,175.4 C67.2 ; U9.2 5.33,172.73 5.33,162.59 6.65,161.28 U12.2 ; U27.2 12.1,90.8 C85.2 ; U27.2 8.01,90.96 5.59,93.38 5.59,103.64 6.74,104.79 7.51,104.79 ; 7.51,104.79 U24.2 12.1,104.79 C82.2 ; U36.2 12.1,48.3 C94.2 ; U12.2 12.1,161.28 C70.2
GND: length 420.9
  Top Layer w0.5: U6.1 8.35,186.6 13.72,186.6 15.24,188.12 C64.1 ; U33.1 8.16,59.85 13.08,59.85 15.24,62.01 C91.1 ; R32.1 1.4,216.33 1.4,220.25 5.59,224.44 P1.2 ; U3.1 8.07,200.82 13.97,200.82 15.24,202.09 C61.1 ; U42.1 8.17,17.94 13.84,17.94 15.24,19.33 C100.1 ; U27.1 8.22,88.04 13.08,88.04 15.24,90.2 C85.1 ; C76.1 15.24,132.24 13.21,130.21 8.29,130.21 U18.1 ; C67.1 15.24,173.89 14.1,172.75 8.11,172.75 U9.1 ; C97.1 15.24,33.18 13.21,31.15 8.63,31.15 U39.1 ; C82.1 15.24,104.55 12.83,102.14 8.12,102.14 U24.1 ; C73.1 15.24,146.71 12.95,144.43 8.04,144.43 U15.1 ; U45.1 8.39,3.21 12.95,3.21 15.24,5.49 C103.1 ; C79.1 15.24,118.14 13.21,116.11 8.29,116.11 U21.1 ; U30.1 8.07,74.07 12.7,74.07 15.24,76.61 C88.1 ; U12.1 8.09,158.66 13.46,158.66 15.24,160.43 C70.1 ; U36.1 8.14,45.63 13.34,45.63 15.24,47.53 C94.1
  Bottom Layer w0.5: P1.2 5.59,224.82 7.11,223.3 7.11,213.39 10.16,210.34 10.16,203.04 U3.1 10.29,198.6 10.29,189.22 U6.1 10.41,184.53 10.41,175.27 U9.1 10.16,170.71 10.16,160.89 U12.1 10.54,156.2 10.54,147 U15.1 8.35,144.46 10.41,142.4 10.41,132.9 U18.1 10.54,127.96 10.54,118.93 U21.1 10.16,114.24 10.16,104.41 U24.1 10.41,99.84 10.41,90.67 U27.1 10.41,85.85 10.41,76.54 U30.1 10.29,71.85 10.29,62.29 U33.1 10.16,57.85 10.16,47.92 U36.1 10.67,43.1 10.67,34.43 U39.1 10.29,29.49 10.29,20.06 U42.1 10.29,15.49 10.29,5.87 U45.1
3+: length 193.3
  Top Layer w0.254: U10.2 24.2,177.81 27.83,177.81 29.23,176.41 29.23,174.81 27.96,173.54 22.28,173.54 C69.2 22.02,170.8 22.73,170.09 46.1,170.09 52.83,163.35 52.83,138.59 53.58,137.84 55.63,137.84 P3.2 ; U6.3 17.28,192.02 18.49,190.81 C65.1 C66.1 20.02,184.94 v1(21.25,183.72) ; R4.1 R4.2
  Bottom Layer w0.254: P3.2 55.39,138.08 53.34,138.08 52.83,138.59 52.83,186.22 48.17,190.88 R4.2 32.85,183.72 v1(21.25,183.72)
4+: length 171.2
  Top Layer w0.254: U9.3 17.28,177.94 18.49,176.73 C68.1 C69.1 20.02,170.89 v1(20.83,170.09) ; U11.2 21.82,165.69 23.95,163.57 27.35,163.57 29.08,161.83 29.08,160 28.11,159.03 22.15,159.03 C72.2 22.02,157.46 23.88,155.61 46.35,155.61 51.05,150.91 51.05,138.61 P3.1 ; R6.1 R6.2
  Bottom Layer w0.254: P3.1 53.58,133.78 51.94,135.42 51.94,173.64 48.79,176.8 R6.2 39.86,176.8 33.15,170.09 v1(20.83,170.09)
5+: length 153.6
  Top Layer w0.254: U12.3 17.28,163.82 18.49,162.61 C71.1 C72.1 20.02,156.54 v1(20.96,155.61) ; P4.2 54.86,126.83 54.84,126.85 52.88,126.85 50.16,129.57 50.16,138.08 46.61,141.64 23.4,141.64 22.28,142.76 22.28,144.63 C75.2 28.37,144.89 29.08,145.6 29.08,147.9 27.56,149.42 24.2,149.42 U16.2 ; R7.1 R7.2
  Bottom Layer w0.254: v1(20.96,155.61) 32.94,155.61 R7.2 41.32,162.68 51.31,152.69 51.31,131.4 P4.2
6+: length 133.8
  Top Layer w0.254: P4.1 50.98,127.92 25.02,127.92 C78.2 28.37,130.92 28.96,131.51 28.96,134.05 27.56,135.45 24.2,135.45 U17.2 ; R10.1 R10.2 ; U15.3 17.28,149.54 18.49,148.33 C74.1 C75.1 20.02,142.44 v1(20.96,141.51)
  Bottom Layer w0.254: P4.1 54.1,124.8 53.54,124.8 51.82,126.53 51.82,130.39 50.95,131.25 50.95,140.51 43.06,148.4 R10.2 33.12,141.51 v1(20.96,141.51)
7+: length 128
  Top Layer w0.254: P5.2 55.71,116.24 51.69,116.24 48.9,113.44 23.88,113.44 22.02,115.3 C81.2 28.37,116.82 28.96,117.41 28.96,119.96 27.56,121.35 24.2,121.35 U22.2 ; v1(21.72,127.67) 20.02,129.36 C78.1 C77.1 18.49,134.37 17.28,135.57 U18.3 ; R11.1 R11.2
  Bottom Layer w0.254: P5.2 49.15,122.8 49.15,131.61 46.32,134.43 R11.2 33.25,127.67 v1(21.72,127.67)
8+: length 130.2
  Top Layer w0.254: P5.1 46.32,112.26 44.96,110.9 44.96,100.36 43.81,99.22 23.24,99.22 22.35,100.11 22.35,102.34 C84.2 28.37,102.67 28.83,103.14 28.83,105.94 27.56,107.2 24.2,107.2 U23.2 ; U21.3 17.28,121.48 18.49,120.27 C80.1 C81.1 20.19,116.65 20.19,114.08 v1(21.08,113.19) ; R14.1 R14.2
  Bottom Layer w0.254: v1(21.08,113.19) 32.87,113.19 R14.2 47.81,120.33 P5.1
9+: length 127.7
  Top Layer w0.254: U24.3 17.28,107.33 18.49,106.12 C83.1 C84.1 20.02,99.9 v1(20.83,99.09) ; U28.2 24.2,93.21 27.69,93.21 28.96,91.94 28.96,89.14 28.49,88.68 C87.2 22.02,86.6 23.11,85.5 42.54,85.5 44.32,87.28 44.32,93.75 P6.2 ; R15.1 R15.2
  Bottom Layer w0.254: v1(20.83,99.09) 32.91,99.09 R15.2 47.51,106.19 48.39,105.31 P6.2
10+: length 141.2
  Top Layer w0.254: R18.1 R18.2 ; P6.1 53.59,101.5 47.5,95.41 47.5,76.36 42.29,71.15 23.24,71.15 22.02,72.37 C90.2 28.37,74.56 28.83,75.02 28.83,77.63 27.37,79.09 24.2,79.09 U29.2 ; v1(20.96,85.38) 20.02,86.31 C87.1 C86.1 18.49,92.13 17.28,93.34 U27.3
  Bottom Layer w0.254: R18.1 49.11,94.73 P6.1 ; R18.2 33.19,85.38 v1(20.96,85.38)
11+: length 158.1
  Top Layer w0.254: R19.1 R19.2 ; v1(21.21,71.15) 20.02,72.34 C90.1 C89.1 18.49,78.01 17.28,79.22 U30.3 ; U34.2 24.2,64.96 27.56,64.96 28.96,63.57 28.96,61.02 28.37,60.43 C93.2 22.02,59.04 23.5,57.56 46.1,57.56 48.13,59.6 48.13,91.35 51.31,94.52 55.09,94.52 55.12,94.55 P7.2
  Bottom Layer w0.254: v1(21.21,71.15) 33.09,71.15 R19.2 44.2,82.26 44.2,87.54 50.73,94.07 55.39,94.07 P7.2
12+: length 176.8
  Top Layer w0.254: U35.2 24.2,50.72 27.56,50.72 28.96,49.32 28.96,46.78 28.37,46.19 C96.2 22.02,44.81 23.88,42.96 46.74,42.96 48.9,45.12 48.9,88.17 51.47,90.74 P7.1 ; U33.3 17.28,65.09 18.49,63.88 C92.1 C93.1 20.02,58.75 v1(21.34,57.44) ; R22.1 R22.2
  Bottom Layer w0.254: v1(21.34,57.44) 33.5,57.44 R22.2 44.07,68.01 44.07,79.92 54.9,90.74 P7.1
13+: length 194.1
  Top Layer w0.254: U36.3 17.28,50.84 18.49,49.63 C95.1 C96.1 20.02,43.89 v1(21.08,42.83) ; U40.2 24.2,36.72 27.34,36.72 29.08,34.98 29.08,33.36 28.03,32.3 22.14,32.3 C99.2 22.02,28.78 22.28,28.53 45.92,28.53 49.66,32.26 49.66,79.2 54.26,83.79 P8.2 ; R23.1 R23.2
  Bottom Layer w0.254: v1(21.08,42.83) 33.14,42.83 R23.2 46.1,55.79 46.1,79.92 49.97,83.79 55.88,83.79 P8.2
14+: length 216.2
  Top Layer w0.254: U41.2 24.2,22.73 27.56,22.73 28.83,21.46 28.83,18.66 28.37,18.2 C102.2 22.02,15.53 22.91,14.64 47.62,14.64 50.6,17.61 50.6,77.81 52.45,79.66 55.56,79.66 P8.1 ; 8.01,36.85 17.28,36.85 18.49,35.64 C98.1 C99.1 20.07,32.15 20.07,29.24 v1(20.76,28.54) ; R26.1 R26.2
  Bottom Layer w0.254: P8.1 55.57,80.3 51.31,80.3 47.88,76.87 47.88,43.58 R26.2 32.85,28.54 v1(20.76,28.54)
15+: length 224.4
  Top Layer w0.254: P9.2 51.69,68.84 51.69,7.91 45.47,1.68 22.86,1.68 22.02,2.52 C105.2 28.37,4.01 28.96,4.6 28.96,7.15 27.56,8.54 24.2,8.54 U46.2 ; R27.1 R27.2 ; v1(21.08,14.76) 20.02,15.82 C102.1 C101.1 18.49,21.65 17.28,22.85 U42.3
  Bottom Layer w0.254: P9.2 50.78,73.03 49.28,71.53 49.28,30.98 R27.2 33.06,14.76 v1(21.08,14.76)
15-: length 110.7
  Top Layer w0.254: v1(20.89,1.87) 20.02,2.74 C105.1 C104.1 18.49,7.46 17.28,8.67 U45.3 ; R30.1 R30.2
  Bottom Layer w0.254: v1(20.89,1.87) 20.96,1.94 34.42,1.94 R30.2 55.88,23.4 P9.1
CELL1+: length 99.6
  Top Layer w0.254: P2.2 55.88,190.15 47.37,198.66 23.37,198.66 22.02,200.01 C63.2 22.17,201.46 28.06,201.46 29.08,202.48 29.08,204.76 28,205.84 24.2,205.84 U4.2
CELL2+: length 202.2
  Top Layer w0.254: P2.1 54.15,146.26 54.15,176.64 46.99,183.8 23.42,183.8 22.02,185.2 C66.2 22.28,187.11 28.58,187.11 29.34,187.87 29.34,190.28 27.97,191.64 27,191.64 26.75,191.9 24.2,191.9 U7.2 ; U3.3 17.28,205.97 18.49,204.76 C62.1 C63.1 20.02,199.59 v1(20.83,198.79) ; R2.1 R2.2
  Bottom Layer w0.254: P2.1 55.88,146.4 54.5,147.78 54.5,148.1 53.72,148.88 53.72,195.05 43.95,204.82 R2.2 33.97,198.79 v1(20.83,198.79)
$1N493: length 5.2
  Top Layer w0.254: U3.4 12.65,208.51 R1.1
$1N497: length 14.2
  Top Layer w0.254: R1.2 16.64,208.12 18.42,206.35 21.34,206.35 22.02,205.66 22.02,204.82 ; C62.2 22.02,204.82 ; 22.02,204.82 25.47,204.82 26.75,203.54
$1N622: length 25.5
  Top Layer w0.254: U4.1 19.82,208.76 20.96,209.9 25.02,209.9 26.75,208.18 26.75,208.14 29.61,208.14 30.99,209.52 32.77,209.52 R2.3
$1N1378: length 5.2
  Top Layer w0.254: R3.1 12.65,194.56 U6.4
$1N1380: length 14.2
  Top Layer w0.254: C65.2 22.02,190.88 ; 22.02,190.88 22.02,191.72 21.34,192.4 18.42,192.4 16.64,194.18 R3.2 ; 22.02,190.88 25.47,190.88 26.75,189.59
$1N1394: length 25.5
  Top Layer w0.254: R4.3 32.77,195.58 30.99,195.58 29.61,194.19 26.75,194.19 26.75,194.23 25.02,195.96 20.96,195.96 19.82,194.82 U7.1
$1N18381: length 5.2
  Top Layer w0.254: U9.4 12.65,180.48 R5.1
$1N18382: length 14.2
  Top Layer w0.254: C68.2 22.02,176.8 ; 22.02,176.8 22.02,177.64 21.34,178.32 18.42,178.32 16.64,180.1 R5.2 ; 22.02,176.8 25.47,176.8 26.75,175.51
$1N18399: length 25.5
  Top Layer w0.254: U10.1 19.82,180.74 20.96,181.88 25.02,181.88 26.75,180.15 26.75,180.12 29.61,180.12 30.99,181.5 32.77,181.5 R6.3
$1N18414: length 25.5
  Top Layer w0.254: R7.3 32.77,167.38 30.99,167.38 29.61,165.99 26.75,165.99 26.75,166.03 25.02,167.76 20.96,167.76 19.82,166.62 U11.1
$1N18415: length 14.2
  Top Layer w0.254: C71.2 22.02,162.68 ; 22.02,162.68 25.47,162.68 26.75,161.39 ; 22.02,162.68 22.02,163.52 21.34,164.2 18.42,164.2 16.64,165.98 R8.2
$1N18416: length 5.2
  Top Layer w0.254: U12.4 12.65,166.36 R8.1
$1N19757: length 5.2
  Top Layer w0.254: U15.4 12.65,152.08 R9.1
$1N19758: length 14.2
  Top Layer w0.254: 22.02,148.4 22.02,149.24 21.34,149.93 18.42,149.93 16.64,151.7 R9.2 ; 22.02,148.4 C74.2 ; 22.02,148.4 25.47,148.4 26.75,147.12
$1N19775: length 25.5
  Top Layer w0.254: U16.1 19.82,152.34 20.96,153.48 25.02,153.48 26.75,151.75 26.75,151.72 29.61,151.72 30.99,153.1 32.77,153.1 R10.3
$1N19794: length 25.5
  Top Layer w0.254: U17.1 19.82,138.37 20.96,139.51 25.02,139.51 26.75,137.78 26.75,137.75 29.61,137.75 30.99,139.13 32.77,139.13 40.01,131.89
$1N19795: length 14.2
  Top Layer w0.254: 26.75,133.15 25.47,134.43 22.02,134.43 ; C77.2 22.02,134.43 ; 22.02,134.43 22.02,135.27 21.34,135.95 18.42,135.95 16.64,137.73 R12.2
$1N19796: length 5.2
  Top Layer w0.254: U18.4 12.65,138.11 R12.1
$1N19805: length 5.2
  Top Layer w0.254: R13.1 12.65,124.02 U21.4
$1N19806: length 14.2
  Top Layer w0.254: 26.75,119.05 25.47,120.33 22.02,120.33 ; 22.02,120.33 C80.2 ; 22.02,120.33 22.02,121.18 21.34,121.86 18.42,121.86 16.64,123.64 R13.2
$1N19823: length 25.5
  Top Layer w0.254: U22.1 19.82,124.27 20.96,125.41 25.02,125.41 26.75,123.69 26.75,123.65 29.61,123.65 30.99,125.03 32.77,125.03 R14.3
$1N19835: length 25.5
  Top Layer w0.254: U23.1 19.82,110.13 20.96,111.27 25.02,111.27 26.75,109.54 26.75,109.5 29.61,109.5 30.99,110.89 32.77,110.89 R15.3
$1N19836: length 14.2
  Top Layer w0.254: 26.75,104.91 25.47,106.19 22.02,106.19 ; R16.2 16.64,109.49 18.42,107.71 21.34,107.71 22.02,107.03 22.02,106.19 ; 22.02,106.19 C83.2
$1N19837: length 5.2
  Top Layer w0.254: U24.4 12.65,109.87 R16.1
$1N21181: length 5.2
  Top Layer w0.254: U27.4 12.65,95.88 R17.1
$1N21182: length 14.2
  Top Layer w0.254: 22.02,92.19 25.47,92.19 26.75,90.91 ; 22.02,92.19 C86.2 ; 22.02,92.19 22.02,93.04 21.34,93.72 18.42,93.72 16.64,95.5 R17.2
$1N21199: length 25.5
  Top Layer w0.254: U28.1 19.82,96.13 20.96,97.27 25.02,97.27 26.75,95.55 26.75,95.51 29.61,95.51 30.99,96.89 32.77,96.89 R18.3
$1N21218: length 25.5
  Top Layer w0.254: R19.3 32.77,82.77 30.99,82.77 29.61,81.39 26.75,81.39 26.75,81.43 25.02,83.15 20.96,83.15 19.82,82.01 U29.1
$1N21219: length 14.2
  Top Layer w0.254: 22.02,78.07 22.02,78.91 21.34,79.6 18.42,79.6 16.64,81.37 R20.2 ; 22.02,78.07 C89.2 ; 22.02,78.07 25.47,78.07 26.75,76.79
$1N21220: length 5.2
  Top Layer w0.254: U30.4 12.65,81.75 R20.1
$1N21229: length 5.2
  Top Layer w0.254: R21.1 12.65,67.63 U33.4
$1N21230: length 14.2
  Top Layer w0.254: R21.2 16.64,67.25 18.42,65.47 21.34,65.47 22.02,64.79 22.02,63.95 ; 22.02,63.95 25.47,63.95 26.75,62.66 ; 22.02,63.95 C92.2
$1N21247: length 25.5
  Top Layer w0.254: U34.1 19.82,67.89 20.96,69.03 25.02,69.03 26.75,67.3 26.75,67.26 29.61,67.26 30.99,68.65 32.77,68.65 R22.3
$1N21259: length 25.5
  Top Layer w0.254: R23.3 32.77,54.4 30.99,54.4 29.61,53.02 26.75,53.02 26.75,53.05 25.02,54.78 20.96,54.78 19.82,53.64 U35.1
$1N21260: length 14.2
  Top Layer w0.254: R24.2 16.64,53 18.42,51.22 21.34,51.22 22.02,50.54 22.02,49.7 ; 22.02,49.7 25.47,49.7 26.75,48.42 ; 22.02,49.7 C95.2
$1N21261: length 5.2
  Top Layer w0.254: R24.1 12.65,53.38 U36.4
$1N22605: length 5.2
  Top Layer w0.254: U39.4 12.65,39.39 R25.1
$1N22606: length 14.2
  Top Layer w0.254: R25.2 16.64,39.01 18.42,37.23 21.34,37.23 22.02,36.55 22.02,35.71 ; 26.75,34.42 25.47,35.71 22.02,35.71 ; 22.02,35.71 C98.2
$1N22623: length 25.5
  Top Layer w0.254: R26.3 32.77,40.41 30.99,40.41 29.61,39.02 26.75,39.02 26.75,39.06 25.02,40.79 20.96,40.79 19.82,39.65 U40.1
$1N22642: length 25.5
  Top Layer w0.254: U41.1 19.82,25.65 20.96,26.79 25.02,26.79 26.75,25.06 26.75,25.03 29.61,25.03 30.99,26.41 32.77,26.41 R27.3
$1N22643: length 14.2
  Top Layer w0.254: R28.2 16.64,25.01 18.42,23.24 21.34,23.24 22.02,22.55 22.02,21.71 ; 22.02,21.71 25.47,21.71 26.75,20.43 ; 22.02,21.71 C101.2
$1N22644: length 5.2
  Top Layer w0.254: R28.1 12.65,25.39 U42.4
$1N22653: length 5.2
  Top Layer w0.254: R29.1 12.65,11.21 U45.4
$1N22654: length 14.2
  Top Layer w0.254: 22.02,7.53 22.02,8.37 21.34,9.05 18.42,9.05 16.64,10.83 R29.2 ; 22.02,7.53 C104.2 ; 22.02,7.53 25.47,7.53 26.75,6.24
$1N22671: length 25.5
  Top Layer w0.254: U46.1 19.82,11.47 20.96,12.61 25.02,12.61 26.75,10.88 26.75,10.84 29.61,10.84 30.99,12.22 32.77,12.22 R30.3
$1N26283: length 4.2
  Top Layer w0.254: Q1.1 8.86,218.33 R31.2
$1N26335: length 8.5
  Top Layer w0.254: 9.03,213.77 8.91,213.9 R32.2 5.83,216.35 R31.1
$1N26450: length 8.4
  Top Layer w0.5: P1.1 9.4,223.81 10.67,222.54 10.67,219.47

Small or netless copper shapes (teardrops, artwork), in the pictures only: 458 on Top Layer, 90 on Bottom Layer

## Text on the board
Bottom Layer: DESIAN BY Which-z
Top Silkscreen Layer: 15+ | 13+ | 10+ | 14+ | 1+ | 4+ | 2+ | 3+ | 12+ | 6+ | 7+ | 8+ | 11+ | 5+ | 9+ | GND | 12V+ | DC12V | CELL5 | CELL6 | CELL7 | CELL8 | CELL9 | CELL10 | CELL11 | CELL12 | CELL13 | CELL15 | CELL1 | CELL2 | CELL3 | CELL4 | CELL14 | 总负 | 总正 | 15串电芯模拟器v2.0__DesignBy Z-Shane
